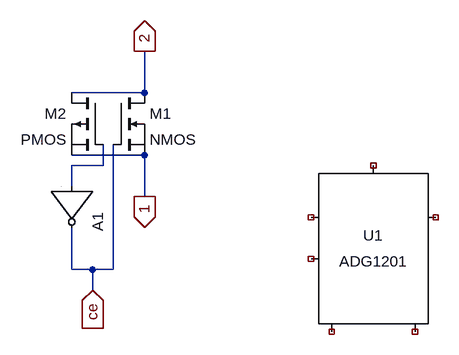
[diagram p0: schematic switch.asc]
switch.asc, the LTspice schematic file:
Version 4
SHEET 1 1192 744
WIRE 736 368 736 304
WIRE 736 368 624 368
WIRE 736 464 624 464
WIRE 672 480 672 448
WIRE 672 480 624 480
WIRE 624 512 624 480
WIRE 736 528 736 464
WIRE 624 640 624 576
WIRE 656 640 624 640
WIRE 688 640 688 448
WIRE 688 640 656 640
WIRE 656 672 656 640
FLAG 656 672 ce
IOPIN 656 672 In
FLAG 736 528 1
IOPIN 736 528 Out
FLAG 736 304 2
IOPIN 736 304 Out
SYMBOL nmos 688 368 R0
SYMATTR InstName M1
SYMBOL pmos 672 368 M0
SYMATTR InstName M2
SYMBOL Digital/inv 688 512 R90
SYMATTR InstName A1
SYMBOL Switches/ADG1201 1088 608 R0
SYMATTR InstName U1

The netlist it stands for:
* switch.asc
M1 2 ce 1 1 NMOS
M2 2 N001 1 1 PMOS
A1 N001 0 0 0 0 ce 0 0 BUF
XU1 NC_01 NC_02 NC_03 NC_04 NC_05 NC_06 ADG1201
.model NMOS NMOS
.model PMOS PMOS
.lib standard.mos
.lib ADG1201.sub
.backanno
.end